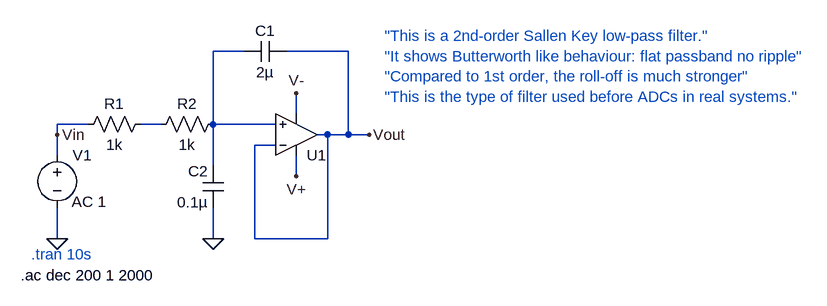
[diagram p0: schematic Assignment_2nd-order_Sallen-Key.asc]
Assignment_2nd-order_Sallen-Key.asc, the LTspice schematic file:
Version 4.1
SHEET 1 1136 680
WIRE 192 -272 144 -272
WIRE 352 -272 256 -272
WIRE 272 -176 272 -208
WIRE -48 -160 -96 -160
WIRE 64 -160 32 -160
WIRE 144 -160 144 -272
WIRE 240 -160 144 -160
WIRE -96 -144 -96 -160
WIRE 320 -144 304 -144
WIRE 352 -144 352 -272
WIRE 352 -144 320 -144
WIRE 384 -144 352 -144
WIRE 240 -128 208 -128
WIRE -96 -112 -96 -144
WIRE 144 -96 144 -160
WIRE 272 -80 272 -112
WIRE -96 16 -96 -32
WIRE 144 16 144 -32
WIRE 208 16 208 -128
WIRE 320 16 320 -144
WIRE 320 16 208 16
FLAG -96 16 0
FLAG 144 16 0
FLAG 384 -144 Vout
FLAG -96 -144 Vin
FLAG 272 -80 V+
FLAG 272 -208 V-
SYMBOL OpAmps\\UniversalOpAmp 272 -144 M180
SYMATTR InstName U1
SYMBOL res 48 -176 R90
WINDOW 0 0 56 VBottom 2
WINDOW 3 32 56 VTop 2
SYMATTR InstName R1
SYMATTR Value 1k
SYMBOL res 160 -176 R90
WINDOW 0 0 56 VBottom 2
WINDOW 3 32 56 VTop 2
SYMATTR InstName R2
SYMATTR Value 1k
SYMBOL voltage -96 -128 R0
WINDOW 123 22 87 Left 2
WINDOW 39 0 0 Left 0
SYMATTR InstName V1
SYMATTR Value ""
SYMATTR Value2 AC 1
SYMBOL cap 256 -288 R90
WINDOW 0 0 32 VBottom 2
WINDOW 3 32 32 VTop 2
SYMATTR InstName C1
SYMATTR Value 2µ
SYMBOL cap 160 -32 R180
WINDOW 0 24 56 Left 2
WINDOW 3 24 8 Left 2
SYMATTR InstName C2
SYMATTR Value 0.1µ
TEXT 408 -296 Left 2 ;"This is a 2nd-order Sallen Key low-pass filter."\n"It shows Butterworth like behaviour: flat passband no ripple"\n"Compared to 1st order, the roll-off is much stronger"\n"This is the type of filter used before ADCs in real systems."
TEXT -136 40 Left 2 ;.tran 10s
TEXT -152 72 Left 2 !.ac dec 200 1 2000

The netlist it stands for:
* Assignment_2nd-order_Sallen-Key.asc
X§U1 N001 Vout V+ V- Vout level1 Avol=1Meg GBW=10Meg Vos=0 En=0 Enk=0 In=0 Ink=0 Rin=500Meg  ; pins In+ In- V+ V- OUT
R1 N002 Vin 1k
R2 N001 N002 1k
V1 Vin 0 AC 1
C1 Vout N001 2µ
C2 0 N001 0.1µ
* "This is a 2nd-order Sallen Key low-pass filter."
* "It shows Butterworth like behaviour: flat passband no ripple"
* "Compared to 1st order, the roll-off is much stronger"
* "This is the type of filter used before ADCs in real systems."
* .tran 10s
.ac dec 200 1 2000
.lib UniversalOpAmp1.lib
.backanno
.end